# Altium project dc-motor-controller.PrjPcb
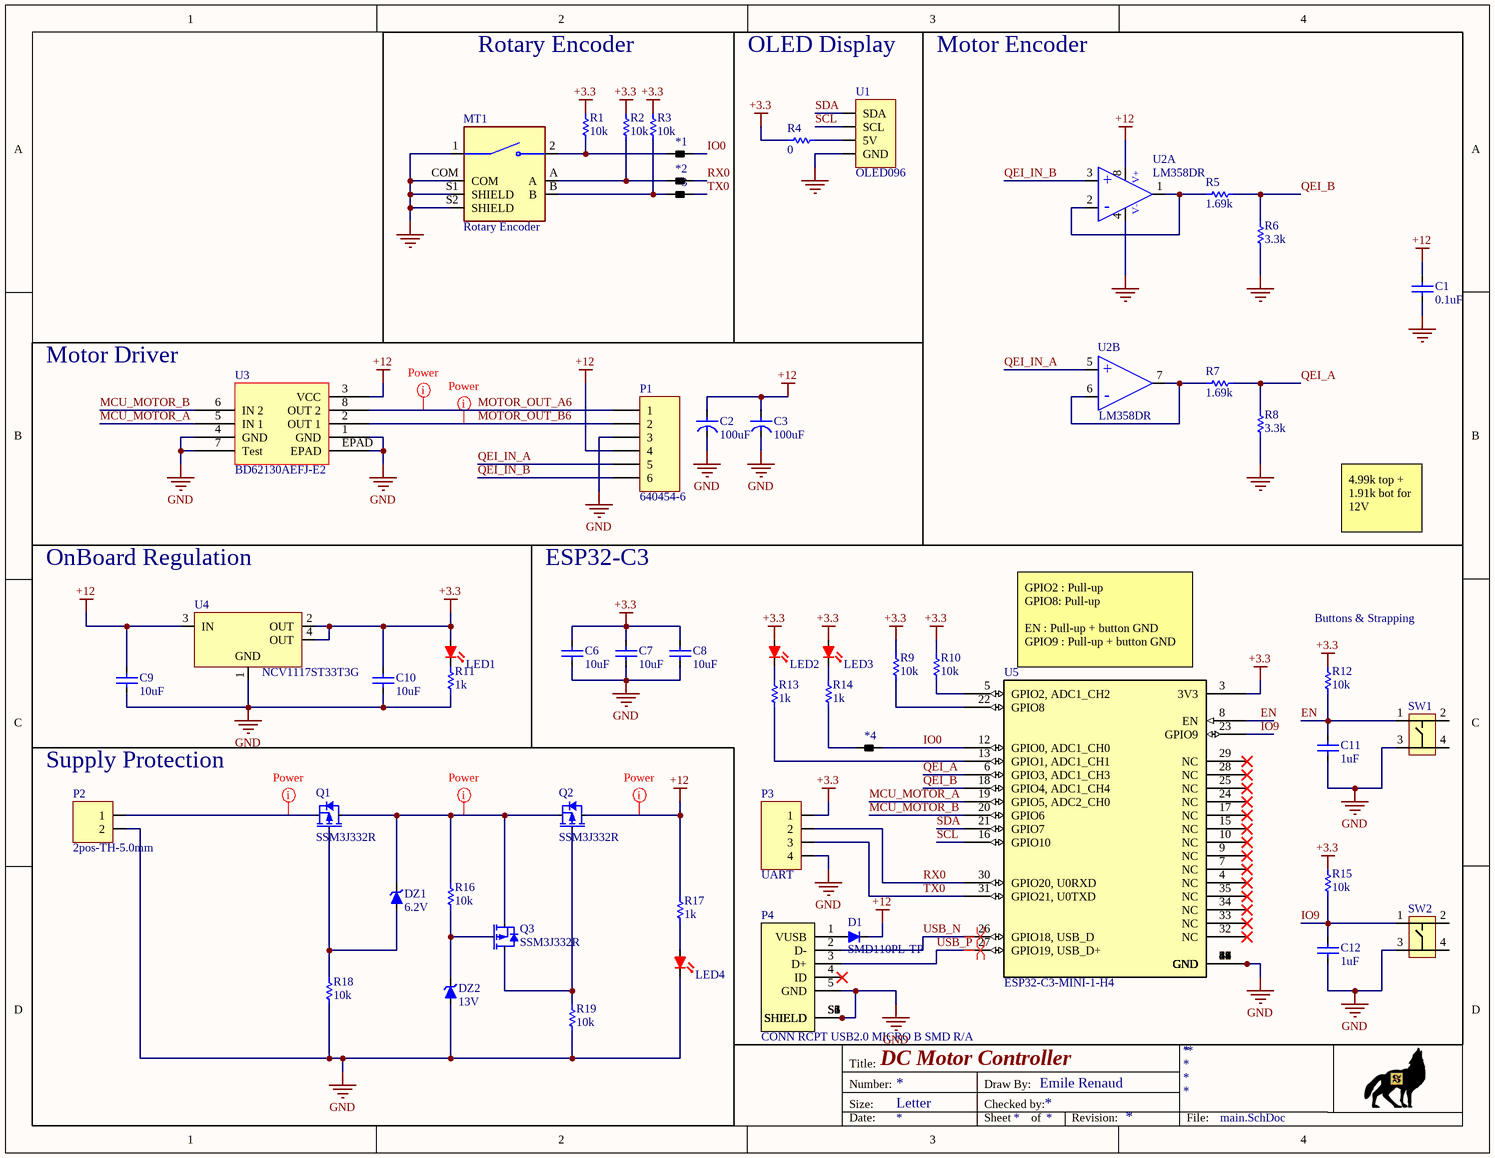
[diagram p0: main.SchDoc]
1 sheet, 55 parts. Net scope: global (net labels, ports and power ports of the same name join across sheets).
Board file: PCB1.PcbDoc

## Sheet main.SchDoc: DC Motor Controller
size Letter; DrawnBy: Emile Renaud

### Parts
*1  NetTie_0603_Short  [NetTie-0603-short]  (value not drawn)
*2  NetTie_0603_Short  [NetTie-0603-short]  (value not drawn)
*3  NetTie_0603_Short  [NetTie-0603-short]  (value not drawn)
*4  NetTie_0603_Short  [NetTie-0603-short]  (value not drawn)
C1  value 0.1uF  [CAPACITOR-0603]  (hidden comment: Capacitor-0603-0.1uF-50V-X7R)
C2  value 100uF  [CAPACITOR-Aluminium-5x11mm-2mmPitch]  (hidden comment: CAP ALUM 100UF 20% 25V RADIAL)
C3  value 100uF  [CAPACITOR-Aluminium-5x11mm-2mmPitch]  (hidden comment: CAP ALUM 100UF 20% 25V RADIAL)
C6  value 10uF  [CAPACITOR-0805]  (hidden comment: Capacitor-0805-10uF-35V-X5R)
C7  value 10uF  [CAPACITOR-0805]  (hidden comment: Capacitor-0805-10uF-35V-X5R)
C8  value 10uF  [CAPACITOR-0805]  (hidden comment: Capacitor-0805-10uF-35V-X5R)
C9  value 10uF  [CAPACITOR-0805]  (hidden comment: Capacitor-0805-10uF-35V-X5R)
C10  value 10uF  [CAPACITOR-0805]  (hidden comment: Capacitor-0805-10uF-35V-X5R)
C11  value 1uF  [CAPACITOR-0603]  (hidden comment: Capacitor-0603-1uF-25V-X5R)
C12  value 1uF  [CAPACITOR-0603]  (hidden comment: Capacitor-0603-1uF-25V-X5R)
D1  SMD110PL-TP  [SOD-123F]
DZ1  Volt: 6.2V  [SOD-123]  (hidden comment: BZT52C6V2-TP)
DZ2  Volt: 13V  [SOD-123]  (hidden comment: BZT52C13-TP)
LED1  B1911USD-20D000114U1930  [LED-0603-2PIN]  (value not drawn)
LED2  B1911USD-20D000114U1930  [LED-0603-2PIN]  (value not drawn)
LED3  B1911USD-20D000114U1930  [LED-0603-2PIN]  (value not drawn)
LED4  B1911USD-20D000114U1930  [LED-0603-2PIN]  (value not drawn)
MT1  Rotary Encoder  [XDCR_PEC11R-4215F-S0024]
P1  640454-6  [640454-6]
P2  2pos-TH-5.0mm  [Weco 2]
P3  UART  [HDR1X4]
P4  CONN RCPT USB2.0 MICRO B SMD R/A  [FCI_10118193-0001LF]
Q1  SSM3J332R  [SOT-23-3]
Q2  SSM3J332R  [SOT-23-3]
Q3  SSM3J332R  [SOT-23-3]
R1  value 10k  [Resistor-0603]  (hidden comment: SMT resistor)
R2  value 10k  [Resistor-0603]  (hidden comment: SMT resistor)
R3  value 10k  [Resistor-0603]  (hidden comment: SMT resistor)
R4  value 0  [Resistor-0603]  (hidden comment: SMT resistor)
R5  value 1.69k  [Resistor-0603]  (hidden comment: SMT resistor)
R6  value 3.3k  [Resistor-0603]  (hidden comment: SMT resistor)
R7  value 1.69k  [Resistor-0603]  (hidden comment: SMT resistor)
R8  value 3.3k  [Resistor-0603]  (hidden comment: SMT resistor)
R9  value 10k  [Resistor-0603]  (hidden comment: SMT resistor)
R10  value 10k  [Resistor-0603]  (hidden comment: SMT resistor)
R11  value 1k  [Resistor-0603]  (hidden comment: SMT resistor)
R12  value 10k  [Resistor-0603]  (hidden comment: SMT resistor)
R13  value 1k  [Resistor-0603]  (hidden comment: SMT resistor)
R14  value 1k  [Resistor-0603]  (hidden comment: SMT resistor)
R15  value 10k  [Resistor-0603]  (hidden comment: SMT resistor)
R16  value 10k  [Resistor-0603]  (hidden comment: SMT resistor)
R17  value 1k  [Resistor-0603]  (hidden comment: SMT resistor)
R18  value 10k  [Resistor-0603]  (hidden comment: SMT resistor)
R19  value 10k  [Resistor-0603]  (hidden comment: SMT resistor)
SW1  PTS815 SJM 250 SMTR LFS  [SW4_PTS815 SJM 250 SMTR LFS_CNK]  (value not drawn)
SW2  PTS815 SJM 250 SMTR LFS  [SW4_PTS815 SJM 250 SMTR LFS_CNK]  (value not drawn)
U1  OLED096  [OLED096]
U2  LM358DR  [SOIC-8]  (parts A,B of 2)
U3  BD62130AEFJ-E2  [P-HSOP8]
U4  NCV1117ST33T3G  [SOT-223-3/TO-261-3S]
U5  ESP32-C3-MINI-1-H4  [ESP32-C3-MINI-1_EXP]

### Nets
+3.3: C6.2 C7.2 C8.2 C10.2 LED1.2(R) LED2.2(R) LED3.2(R) P3.1 R1.1 R2.1 R3.1 R4.1 R9.1 R10.1 R12.2 R15.2 U4.2(OUT) U4.4(OUT) U5.3(3V3)
+12: C1.2 C2.1 C3.1 C9.2 D1.2(K) P1.4 Q2.3(D) R17.2 U2.8(VS+) U3.3(VCC) U4.3(IN)
GND: C1.1 C2.2 C3.2 C6.1 C7.1 C8.1 C9.1 C10.1 C11.1 C12.1 DZ2.1(A) LED4.1(K) MT1.1 MT1.COM MT1.S1(SHIELD) MT1.S2(SHIELD) P1.3 P2.2 P3.4 P4.5(GND) P4.S1(SHIELD) P4.S2(SHIELD) P4.S3(SHIELD) P4.S4(SHIELD) P4.S5(SHIELD) P4.S6(SHIELD) R6.1 R8.1 R11.1 R18.1 R19.1 SW1.3 SW2.3 U1.1(GND) U2.4(VS-) U3.1(GND) U3.4(GND) U3.7(Test) U3.EPAD U4.1(GND) U5.1(GND) U5.2(GND) U5.11(GND) U5.14(GND) U5.36(GND) U5.37(GND) U5.38(GND) U5.39(GND) U5.40(GND) U5.41(GND) U5.42(GND) U5.43(GND) U5.44(GND) U5.45(GND) U5.46(GND) U5.47(GND) U5.48(GND) U5.49(GND) U5.50(GND) U5.51(GND) U5.52(GND) U5.53(GND) U5.54(GND) U5.55(GND) U5.56(GND) U5.57(GND) U5.58(GND) U5.59(GND) U5.60(GND) U5.61(GND)
EN: C11.2 R12.1 SW1.1 U5.8(EN)
IO0: *1.1 *4.1 U5.12(GPIO0,_ADC1_CH0)
IO9: C12.2 R15.1 SW2.1 U5.23(GPIO9)
MCU_MOTOR_A: U3.5(IN_1) U5.19(GPIO5,_ADC2_CH0)
MCU_MOTOR_B: U3.6(IN_2) U5.20(GPIO6)
MOTOR_OUT_A6: P1.1 U3.8(OUT_2)
MOTOR_OUT_B6: P1.2 U3.2(OUT_1)
QEI_A: R7.2 R8.2 U5.6(GPIO3,_ADC1_CH3)
QEI_B: R5.2 R6.2 U5.18(GPIO4,_ADC1_CH4)
QEI_IN_A: P1.5 U2.5(IN2+)
QEI_IN_B: P1.6 U2.3(IN1+)
RX0: *2.1 P3.2 U5.30(GPIO20,_U0RXD)
SCL: U1.3(SCL) U5.16(GPIO10)
SDA: U1.4(SDA) U5.21(GPIO7)
TX0: *3.1 P3.3 U5.31(GPIO21,_U0TXD)
USB_N: P4.2(D-) U5.26(GPIO18,_USB_D)
USB_P: P4.3(D+) U5.27(GPIO19,_USB_D+)
Net*1_2: *1.2 MT1.2 R1.2
Net*2_2: *2.2 MT1.A R2.2
Net*3_2: *3.2 MT1.B R3.2
Net*4_2: *4.2 R14.1
NetD1_1: D1.1(A) P4.1(VUSB)
NetDZ1_1: DZ1.1(A) Q1.1(G) R18.2
NetDZ1_2: DZ1.2(K) Q1.3(D) Q2.2(S) Q3.2(S) R16.2
NetDZ2_2: DZ2.2(K) Q3.1(G) R16.1
NetLED1_1: LED1.1(K) R11.2
NetLED2_1: LED2.1(K) R13.2
NetLED3_1: LED3.1(K) R14.2
NetLED4_2: LED4.2(R) R17.1
NetP2_1: P2.1 Q1.2(S)
NetQ2_1: Q2.1(G) Q3.3(D) R19.2
NetR4_2: R4.2 U1.2(5V)
NetR5_1: R5.1 U2.1(OUT1) U2.2(IN1-)
NetR7_1: R7.1 U2.6(IN2-) U2.7(OUT)
NetR9_2: R9.2 U5.22(GPIO8)
NetR10_2: R10.2 U5.5(GPIO2,_ADC1_CH2)
NetR13_1: R13.1 U5.13(GPIO1,_ADC1_CH1)

Not connected (* = marked no-connect by the designer): P4 4(ID)*; SW1 2 4; SW2 2 4; U5 4(NC)* 7(NC)* 9(NC)* 10(NC)* 15(NC)* 17(NC)* 24(NC)* 25(NC)* 28(NC)* 29(NC)* 32(NC)* 33(NC)* 34(NC)* 35(NC)*

### Layout directives
differential pair: USB_N, USB_P
net class Power: +12, MOTOR_OUT_A6, MOTOR_OUT_B6, NetDZ1_2, NetP2_1

### Notes on the sheet
- Rotary Encoder
- OLED Display
- Motor Encoder
- (near U3) Motor Driver
- OnBoard Regulation
- ESP32-C3
- 4.99k top + 1.91k bot for 12V
- (near R12) Buttons & Strapping
- (near U5) GPIO2 : Pull-up
  GPIO8: Pull-up
  EN : Pull-up + button GND
  GPIO9 : Pull-up + button GND
- Supply Protection
- Title:
- Size:
- Number:
- Letter
- Draw By:
- Checked by:
- Date:
- Sheet
- of
- Revision:
- File:
- (in symbol LM358DR, part A) V+; +; -; V-
- (in symbol LM358DR, part B) +; -

### Library data of the parts
C1 = Capacitor-0603-0.1uF-50V-X7R: Precision: X7R-10%; Volt: 50V; Package / Case: Metric 1608, EIA 0603; Mounted: Yes; Supplier 1: Digi-Key; Supplier Part Number 1: 1276-1935-2-ND; Supplier 2: Digi-Key; Supplier 3: Digi-Key; Supplier 4: Digi-Key; Supplier Part Number 2: 1276-1934-2-ND
C2 C3 = Capacitor-100uF-25V: Volt: 25V; Precision: 20%; Mounted: Yes; Supplier 1: Digi-Key; Supplier Part Number 1: 399-6102-ND; Supplier 2: Digi-Key; Supplier 3: Digi-Key; Supplier 4: Digi-Key
C6-C10 = Capacitor-0805-10uF-35V-X5R: Precision: X5R-10%; Volt: 35V; Package / Case: Metric 2012 , EIA 0805; Mounted: Yes; Supplier 1: Digi-Key; Supplier Part Number 1: 490-10515-1-ND; Supplier 2: Digi-Key; Supplier 3: Digi-Key; Supplier 4: Digi-Key
C11 C12 = Capacitor-0603-1uF-25V-X5R: Precision: X5R-10%; Volt: 25V; Package / Case: Metric 1608, EIA 0603; Mounted: Yes; Supplier 1: Digi-Key; Supplier Part Number 1: 1276-1859-2-ND; Supplier 2: Digi-Key; Supplier 3: Digi-Key; Supplier 4: Digi-Key; Supplier Part Number 2: 1276-1942-2-ND
D1 = SMD110PL-TP: DIODE SCHOTTKY 100V 1A SOD123FL; Supplier 1: Digi-Key; Supplier Part Number 1: SMD110PL-TPMSTR-ND; Mounted: Yes; Package / Case: SOD123FL; Volt: 100V
DZ1 = BZT52C6V2-TP: Zener Diode 6.2 V 200 mW ±6% Surface Mount SOD-123; Watt: 200mW; Grade: None; Package / Case: SOD-123; Supplier 1: Digi-Key; Supplier Part Number 1: BZT52C13-TPMSCT-ND; Mounted: Yes; Precision: 6%
DZ2 = BZT52C13-TP: Zener Diode 13 V 200 mW ±6% Surface Mount SOD-123; Watt: 200mW; Grade: None; Package / Case: SOD-123; Supplier 1: Digi-Key; Supplier Part Number 1: BZT52C13-TPMSCT-ND; Mounted: Yes; Precision: 6%
LED1-LED4 = B1911USD-20D000114U1930: LED RED CLEAR 1608 SMD; Package / Case: 0603 (1608 Metric); Mounted: Yes; Supplier 1: Digi-Key; Supplier Part Number 1: 3147-B1911USD-20D000114U1930CT-ND
MT1 = PEC11R-4215F-S0024: Incremental Encoder, 12 Mm, Contact Rating 10 Ma - 5 Vdc; Price: None; Availability: Unavailable; MP: PEC11R-4215F-S0024; Value: *; Package: None
P1 = 640454-6: CONN HEADER VERT 6POS .100 TIN; Manufacturer: TE Connectivity AMP Connectors; Connector Type: Header, Unshrouded; Pitch: 0.100" (2.54mm); Number of Positions: 6; Number of Positions Loaded: All; Supplier 1: Digi-Key; Supplier Part Number 1: A19433-ND; Category: Connectors, Interconnects; Packaging: Bulk; Part Status: Active; Contact Type: Male Pin; Number of Rows: 1; Row Spacing: -; Mounting Type: Through Hole; Termination: Solder; Fastening Type: -; Contact Mating Length: 0.295" (7.49mm); Features: Polarizing Key; Contact Finish: Tin; Contact Finish Thickness: -; Color: Natural; ComponentLink1URL: http://www.te.com/commerce/DocumentDelivery/DDEController?Action=srchrtrv&DocNm=640454&DocType=Customer+Drawing&DocLang=English; ComponentLink1Description: http://www.te.com/commerce/DocumentDelivery/DDEController?Action=srchrtrv&DocNm=640454&DocType=Customer+Drawing&DocLang=English; Manufacturer Part Number: 640454-6
P2 = 2pos-TH-5.0mm: 2pos-TH-5.0mm Screw Terminal; Supplier 1: Digi-Key; Supplier Part Number 1: N/A277-1667-ND; Mounted: Yes; Package / Case: TH; Volt: N/A
P3 = 4pos-TH-2.54mm: 4pos TH 2.54mm Header; Supplier 1: Digi-Key; Supplier Part Number 1: N/A; Mounted: Yes; Package / Case: TH; Volt: N/A
P4 = USB-Micro: USB - micro B USB 2.0 Receptacle Connector 5 Position Surface Mount, Right Angle; Through Hole; Supplier 1: Digikey; Supplier Part Number 1: 609-4616-2-ND; Mounted: Yes; Package / Case: SMD; Volt: N/A
Q1-Q3 = SSM3J332R: P-Channel 30 V 6A (Ta) 1W (Ta) Surface Mount SOT-23F; Volt: 30V; Supplier 1: Digi-Key; Supplier Part Number 1: SSM3J332RLFCT-ND; Package / Case: SOT-523; Mounted: Yes; Current: 6A
R1-R3 R9 R10 R12 R15 R16 R18 R19 = Resistor0603-10k: Precision: 1%; Watt: 0.1W; Mounted: Yes; Package / Case: Metric 1608, EIA 0603; Supplier 2: Digi-Key; Supplier 4: Digi-Key; Supplier Part Number 2: RMCF0603FT10K0TR-ND; Supplier 1: Digi-Key; Supplier 3: Digi-Key; Supplier Part Number 1: 311-10.0KHRTR-ND
R4 = Resistor0603-0.0: Precision: 1%; Watt: 0.1W; Mounted: Yes; Package / Case: Metric 1608, EIA 0603; Supplier 2: Digi-Key; Supplier 4: Digi-Key; Supplier Part Number 2: 1276-3510-2-ND; Supplier Part Number 4: 541-0.0GTR-ND; Supplier 1: Digi-Key; Supplier 3: Digi-Key; Supplier Part Number 1: RMCF0603ZT0R00TR-ND; Supplier Part Number 3: YAG1307TR-ND
R5 R7 = Resistor0603-1.69k: Precision: 1%; Watt: 0.25W; Mounted: Yes; Package / Case: Metric 1608, EIA 0603; Supplier 2: Digi-Key; Supplier 4: Digi-Key; Supplier 1: Digi-Key; Supplier 3: Digi-Key; Supplier Part Number 1: RMCF0603FT1K69CT-ND
R6 R8 = Resistor0603-3.3k: Precision: 5%; Watt: 0.25W; Mounted: Yes; Package / Case: Metric 1608, EIA 0603; Supplier 2: Digi-Key; Supplier 4: Digi-Key; Supplier 1: Digi-Key; Supplier 3: Digi-Key; Supplier Part Number 1: 311-3.30KHRCT-ND
R11 R13 R14 R17 = Resistor0603-1k: Precision: 1%; Watt: 0.1W; Mounted: Yes; Package / Case: Metric 1608, EIA 0603; Supplier 2: Digi-Key; Supplier 4: Digi-Key; Supplier Part Number 2: 311-1.00KHRTR-ND; Supplier 1: Digi-Key; Supplier 3: Digi-Key; Supplier Part Number 1: RMCF0603FT1K00TR-ND; Supplier Part Number 3: AG1307TR-ND
SW1 SW2 = PTS815 SJM 250 SMTR LFS: TACT 4.2 X 3.2, 2.5 MM H, 180GF,; Volt: 12V; Current: 0.05A; Supplier 1: Digi-Key; Supplier Part Number 1: CKN12215-1-ND; Mounted: Yes
U1 = OLED096: OLED Display I2C 0.96in; Precision: 3%; Supplier 1: Amazon; Supplier Part Number 1: https://www.amazon.ca/-/fr/SSD1306-broches-Arduino-Raspberry-jaune-bleu-IIC/dp/B076PNP2VD/ref=sr_1_5?crid=2VV3LXPB89L69&keywords=i2c+oled&qid=1687918090&sprefix=%2Caps%2C88&sr=8-5; Value: N/A; Package / Case: 0603 (1608 Metric); Mounted: Yes
U2 = LM358DR: IC OPAMP GP 2 CIRCUIT 8SOIC; Grade: None; Package / Case: SOIC-8; Mounted: Yes; helpURL: https://www.digikey.ca/en/products/detail/texas-instruments/LM358DR/276658?s=N4IgTCBcDa4JwDYC0BGADCgLEsSByAIiALoC%2BQA; Supplier 1: Digi-Key; Supplier Part Number 1: 296-1014-2-ND
U3 = BD62130AEFJ-E2: 1 CHANNEL H BRIDGE Motor. 28V, 3A; Supplier 1: Digi-Key; Supplier Part Number 1: BD62130AEFJ-E2CT-ND; Package / Case: 8-HTSOP-J; Mounted: Yes
U4 = NCV1117ST33T3G: IC REG LINEAR 3.3V 1A SOT223; Supplier 1: Digi-Key; Supplier Part Number 1: NCV1117ST33T3GOSCT-ND; Package / Case: SOT223; Mounted: Yes
U5 = ESP32-C3-MINI-1-N4: Bluetooth, WiFi 802.11b/g/n, Bluetooth v5.0 Transceiver Module 2.412GHz ~ 2.484GHz PCB Trace Surface Mount; Mfr_Name: Espressif Systems; Copyright: Copyright (C) 2023 Ultra Librarian. All rights reserved.; Manufacturer_Part_Number: ESP32-C3-MINI-1-N4; RefDes: RefDes; Type: Type; Datasheet: https://www.espressif.com/sites/default/files/documentation/esp32-c3-mini-1_datasheet_en.pdf